# EAGLE board Shutdown_2019_v1.0 (EAGLE 9.1.2)
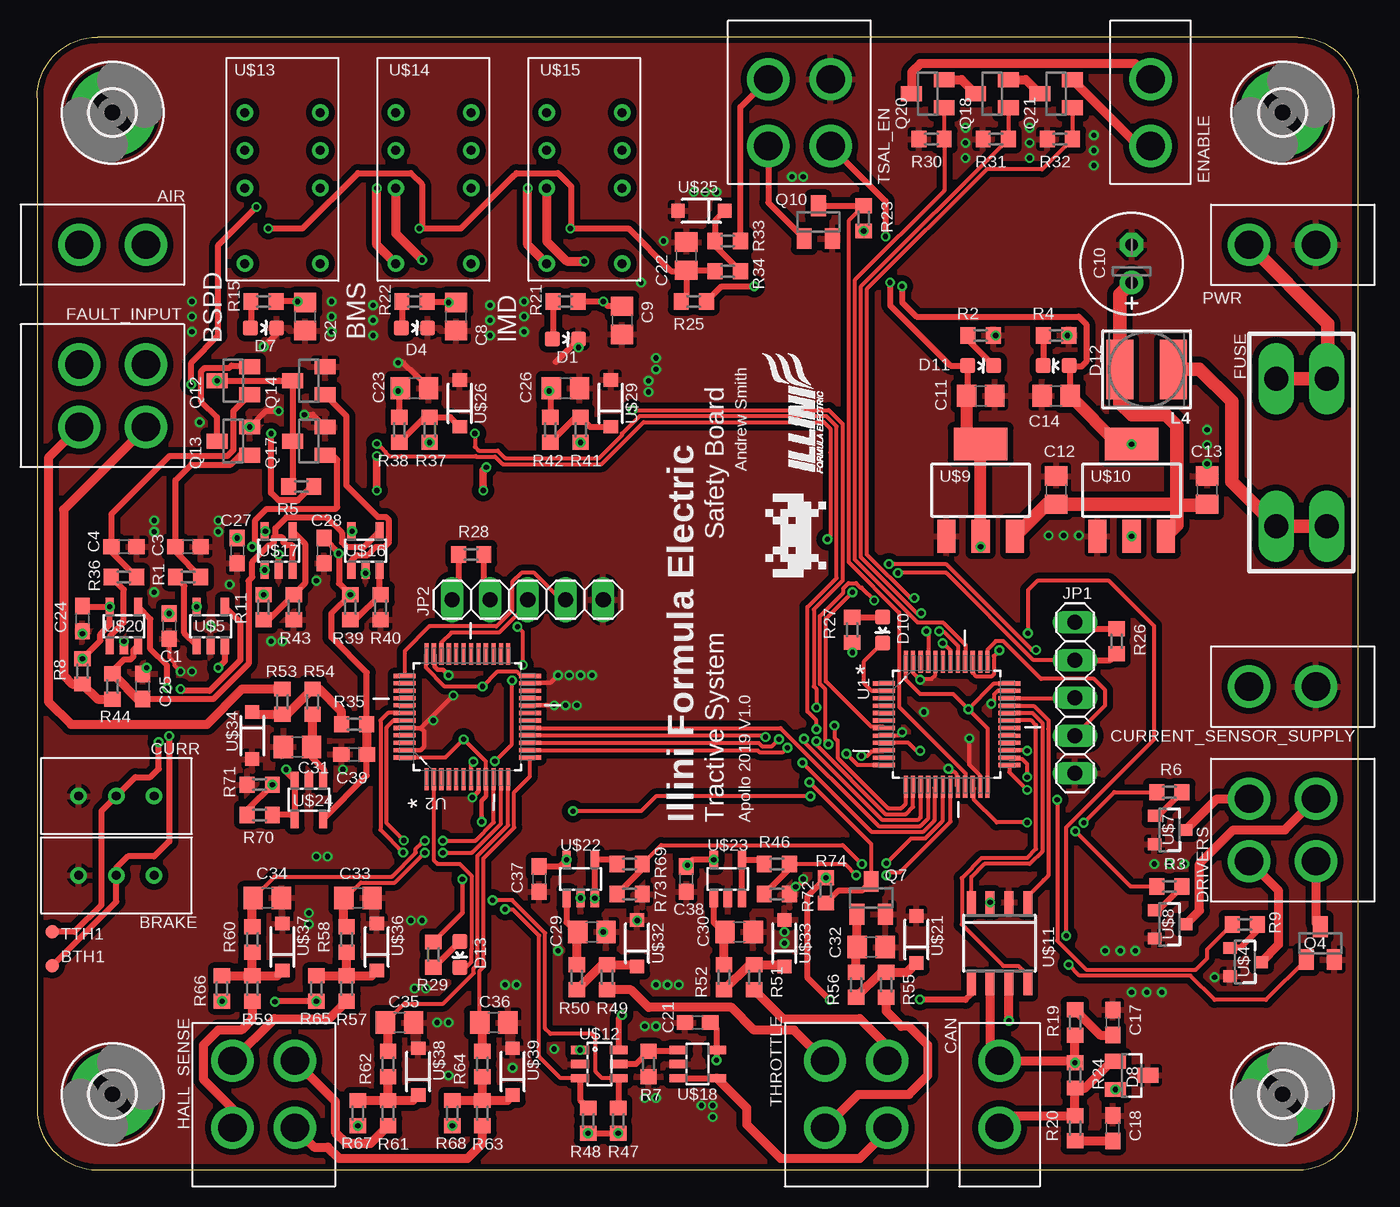
[diagram p10: board, top side]
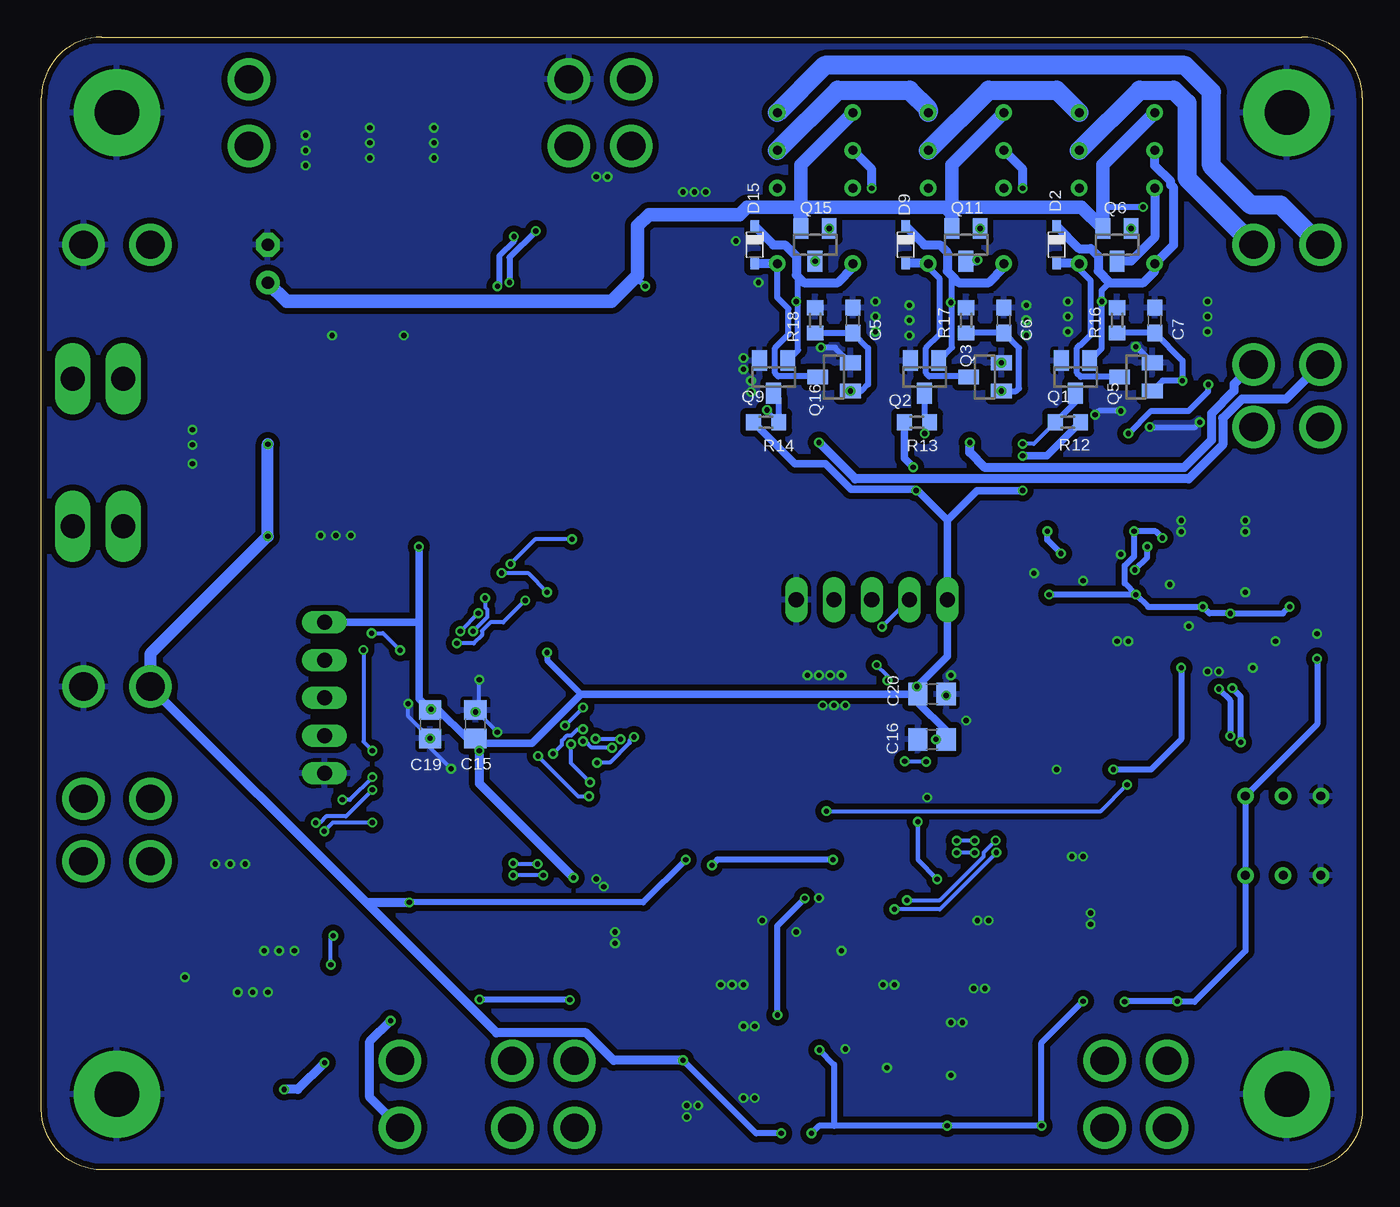
[diagram p11: board, bottom side, seen from below]

Size 88.9 x 76.2 mm. Coordinates in mm from the lower left corner, seen from the top.
Outline: 4.06,0 84.84,0 arc90 88.9,4.06 88.9,72.14 arc90 84.84,76.2 4.06,76.2 arc90 0,72.14 0,4.06 arc90 4.06,0
Copper layers (1*16): Top 0.035mm / dielectric 1.5mm / Bottom 0.035mm
Design rules "SeeedStudio_2layer_DRU_no_angle_20140221": minimum track width 6mil, minimum drill 12mil, track to track 6mil, track to pad 6mil, pad to pad 6mil, via to via 6mil, smd to smd 0mil, copper to edge 10mil, drill to drill 10mil, minimum pad ring 10mil, minimum via ring 6mil, stop-mask expansion 2mil, vias tented up to drill 100mil, thermal gap 10mil
Net classes: 0 default: width 0.254 mm; 1 PWR: width 0.254 mm; 2 AIR: width 1.27 mm; 3 PWR_IN: width 0.406 mm

## Footprints (pad centres in the part's own frame; a part is rotated, then mirrored left to right if it is on the bottom)
MINIFIT_JR_5566-02 = drill 1.9: 1 0,2.25; 2 0,-2.25
PV36 = drill 0.6: A -2.54,0; B 2.54,0; W 0,0
TP09R = smd 0.9 x 0.9: TP 0,0
C0603 = smd 1.1 x 1: 1 -0.85,0; 2 0.85,0
C0805 = smd 1.3 x 1.5: 1 -0.95,0; 2 0.95,0
E2,5-7 = drill 0.813 pad 1.6: + -1.27,0 | drill 0.813 pad 1.6 octagon: - 1.27,0
LED-0603 = smd 1 x 1: A 0,-0.877; C 0,0.877
SOD323-F = smd 0.8 x 0.6: A 1.25,0; C -1.25,0
SOT23 = smd 1 x 1.4: 1 -0.95,-1.1; 2 0.95,-1.1; 3 0,1.1
MINIFIT_JR_5566-04 = drill 1.9: 1 -2.1,2.25; 2 2.1,2.25; 3 -2.1,-2.25; 4 2.1,-2.25
3568 = drill 1.6 long: P$1 -4.96,1.7; P$2 4.96,1.7; P$3 4.96,-1.7; P$4 -4.96,-1.7
3,0-PAD = drill 3 pad 5.842: B3,0 0,0
1X05 = drill 1.016 long: 1 -5.08,0; 2 -2.54,0; 3 0,0; 4 2.54,0; 5 5.08,0
INDUCTOR_5X5MM_NR5040_NOTHERMALS = smd 1.8 x 4: P$1 -1.8,0; P$2 1.8,0
R0603 = smd 1 x 1.1: 1 -0.85,0; 2 0.85,0
QFP50P900X900X160-48N = smd 1.473 x 0.279: 1 -4.216,2.743; 2 -4.216,2.261; 3 -4.216,1.753; 4 -4.216,1.245; 5 -4.216,0.762; 6 -4.216,0.254; 7 -4.216,-0.254; 8 -4.216,-0.762; 9 -4.216,-1.245; 10 -4.216,-1.753; 11 -4.216,-2.261; 12 -4.216,-2.743; 25 4.216,-2.743; 26 4.216,-2.261; 27 4.216,-1.753; 28 4.216,-1.245; 29 4.216,-0.762; 30 4.216,-0.254; 31 4.216,0.254; 32 4.216,0.762; 33 4.216,1.245; 34 4.216,1.753; 35 4.216,2.261; 36 4.216,2.743 | smd 0.279 x 1.473: 13 -2.743,-4.216; 14 -2.261,-4.216; 15 -1.753,-4.216; 16 -1.245,-4.216; 17 -0.762,-4.216; 18 -0.254,-4.216; 19 0.254,-4.216; 20 0.762,-4.216; 21 1.245,-4.216; 22 1.753,-4.216; 23 2.261,-4.216; 24 2.743,-4.216; 37 2.743,4.216; 38 2.261,4.216; 39 1.753,4.216; 40 1.245,4.216; 41 0.762,4.216; 42 0.254,4.216; 43 -0.254,4.216; 44 -0.762,4.216; 45 -1.245,4.216; 46 -1.753,4.216; 47 -2.261,4.216; 48 -2.743,4.216
SOT23-3 = smd 0.8 x 0.9: 1 -0.95,-1; 2 0.95,-1; 3 0,1.1
SOT23-5 = smd 0.55 x 1.2: 1 -0.95,-1.3; 2 0,-1.3; 3 0.95,-1.3; 4 0.95,1.3; 5 -0.95,1.3
SOT223 = smd 1.219 x 2.235: 1 -2.311,-3.099; 2 0,-3.099; 3 2.311,-3.099 | smd 3.6 x 2.2: 4 0,3.099
SOIC8 = smd 0.6 x 1.5: 1 -1.905,-2.75; 2 -0.635,-2.75; 3 0.635,-2.75; 4 1.905,-2.75; 5 1.905,2.75; 6 0.635,2.75; 7 -0.635,2.75; 8 -1.905,2.75
SOT23-6 = smd 0.55 x 1.2: 1 -0.95,-1.3; 2 0,-1.3; 3 0.95,-1.3; 4 0.95,1.3; 5 0,1.3; 6 -0.95,1.3
DPDT_2.54 = drill 0.6: $P1 -6.35,2.54; $P3 -1.27,2.54; $P4 1.27,2.54; $P5 3.81,2.54; $P8 3.81,-2.54; $P9 1.27,-2.54; $P10 -1.27,-2.54; $P12 -6.35,-2.54
SOD-123 = smd 0.9 x 0.95: A 1.575,0; C -1.575,0

## Placement (x,y rotation side)
AIR  MINIFIT_JR_5566-02  [MINIFIT_JR_5566-02]  5.08,62.23 270 top
BRAKE  PV36  [PV36]  5.33,19.81 180 top
BTH1  TPTP09R  [TP09R]  1.02,13.72 270 top
C1  0.1u  [C0603]  8.89,36.58 270 top
C2  10uF  [C0805]  18.03,57.4 270 top
C3  3u  [C0603]  10.16,41.91 0 top
C4  3u  [C0603]  5.84,41.91 0 top
C5  0.1u  [C0603]  34.29,57.15 90 bottom
C6  0.1u  [C0603]  24.13,57.15 90 bottom
C7  0.1u  [C0603]  13.97,57.15 90 bottom
C8  10uF  [C0805]  28.19,57.4 270 top
C9  10uF  [C0805]  39.37,57.15 270 top
C10  220u  [E2,5-7]  73.66,60.96 90 top
C11  2.2u  [C0805]  63.5,52.07 0 top
C12  4.7u  [C0805]  68.58,45.72 90 top
C13  4.7u  [C0805]  78.74,45.72 90 top
C14  2.2u  [C0805]  68.58,52.07 180 top
C15  1u  [C0805]  59.69,29.97 90 bottom
C16  1u  [C0805]  28.96,28.96 180 bottom
C17  560p  [C0603]  72.39,9.91 90 top
C18  560p  [C0603]  72.39,2.79 90 top
C19  1u  [C0805]  62.74,29.97 270 bottom
C20  1u  [C0805]  28.96,32 0 bottom
C21  1u  [C0603]  44.45,9.91 180 top
C22  0.1u  [C0805]  43.69,61.47 90 top
C23  0.1u  [C0805]  25.4,52.58 0 top
C24  0.1u  [C0603]  3.05,37.08 270 top
C25  0.01u  [C0603]  7.11,32.51 90 top
C26  0.1u  [C0805]  35.56,52.58 0 top
C27  0.1u  [C0603]  13.46,41.66 270 top
C28  0.1u  [C0603]  19.3,41.66 270 top
C29  0.1u  [C0805]  37.34,16 0 top
C30  0.1u  [C0805]  47.24,16 0 top
C31  0.001u  [C0805]  17.53,28.45 180 top
C32  0.1u  [C0805]  56.13,14.99 0 top
C33  0.001u  [C0805]  21.59,18.29 0 top
C34  0.001u  [C0805]  15.49,18.29 0 top
C35  0.001u  [C0805]  24.38,9.91 0 top
C36  0.001u  [C0805]  30.73,9.91 0 top
C37  0.1u  [C0603]  33.78,19.56 270 top
C38  0.1u  [C0603]  43.69,19.56 270 top
C39  0.1u  [C0603]  21.34,27.94 180 top
CAN  MINIFIT_JR_5566-02  [MINIFIT_JR_5566-02]  64.77,5.08 0 top
CURR  PV36  [PV36]  5.33,25.15 180 top
CURRENT_SENSOR_SUPPLY  MINIFIT_JR_5566-02  [MINIFIT_JR_5566-02]  83.82,32.51 90 top
D1  BLUE  [LED-0603]  35.56,55.88 270 top
D2  1N914  [SOD323-F]  20.57,62.23 270 bottom
D4  BLUE  [LED-0603]  25.4,56.64 270 top
D7  BLUE  [LED-0603]  15.24,56.64 270 top
D8  PESD1  [SOT23]  73.66,6.35 270 top
D9  1N914  [SOD323-F]  30.73,62.23 270 bottom
D10  RED  [LED-0603]  56.9,36.32 180 top
D11  GREEN  [LED-0603]  63.5,54.1 270 top
D12  GREEN  [LED-0603]  68.58,54.1 90 top
D13  RED  [LED-0603]  28.45,14.48 180 top
D15  1N914  [SOD323-F]  40.89,62.23 270 bottom
DRIVERS  MINIFIT_JR_5566-04  [MINIFIT_JR_5566-04]  83.82,22.86 90 top
ENABLE  MINIFIT_JR_5566-02  [MINIFIT_JR_5566-02]  74.93,71.12 180 top
FAULT_INPUT  MINIFIT_JR_5566-04  [MINIFIT_JR_5566-04]  5.08,52.07 270 top
FUSE  MINI297-3568  [3568]  85.09,48.26 270 top
H1  MOUNT-PAD-ROUND3.0  [3,0-PAD]  83.82,71.12 0 top
H2  MOUNT-PAD-ROUND3.0  [3,0-PAD]  83.82,5.08 0 top
H3  MOUNT-PAD-ROUND3.0  [3,0-PAD]  5.08,5.08 0 top
H4  MOUNT-PAD-ROUND3.0  [3,0-PAD]  5.08,71.12 0 top
HALL_SENSE  MINIFIT_JR_5566-04  [MINIFIT_JR_5566-04]  15.24,5.08 0 top
JP1  [1X05]  69.85,31.75 270 top
JP2  [1X05]  33.02,38.35 0 top
L4  10u  [INDUCTOR_5X5MM_NR5040_NOTHERMALS]  74.68,53.85 180 top
PWR  MINIFIT_JR_5566-02  [MINIFIT_JR_5566-02]  83.82,62.23 90 top
Q1  DMN6140L-7  [SOT23]  19.3,53.34 180 bottom
Q2  DMN6140L-7  [SOT23]  29.46,53.34 180 bottom
Q3  DMN6140L-7  [SOT23]  25.4,53.34 90 bottom
Q4  DMN6140L-7  [SOT23]  86.36,15.24 0 top
Q5  DMN6140L-7  [SOT23]  15.24,53.34 90 bottom
Q6  DMP3099L-7  [SOT23]  16.51,62.23 180 bottom
Q7  DMN6140L-7  [SOT23]  56.13,18.29 0 top
Q9  DMN6140L-7  [SOT23]  39.62,53.34 180 bottom
Q10  DMN6140L-7  [SOT23]  52.58,63.75 0 top
Q11  DMP3099L-7  [SOT23]  26.67,62.23 180 bottom
Q12  IRLML6346PBF  [SOT23]  13.21,53.09 90 top
Q13  IRLML6346PBF  [SOT23]  13.21,49.02 90 top
Q14  IRLML6346PBF  [SOT23]  18.29,53.09 90 top
Q15  DMP3099L-7  [SOT23]  36.83,62.23 180 bottom
Q16  DMN6140L-7  [SOT23]  35.56,53.34 90 bottom
Q17  IRLML6346PBF  [SOT23]  18.29,49.02 90 top
Q18  DMN6140L-7  [SOT23]  64.26,72.39 90 top
Q20  DMN6140L-7  [SOT23]  59.94,72.39 90 top
Q21  DMN6140L-7  [SOT23]  68.58,72.39 90 top
R1  100k  [R0603]  10.16,39.88 180 top
R2  100  [R0603]  63.5,56.13 180 top
R3  3.6k  [R0603]  76.2,19.05 0 top
R4  100  [R0603]  68.58,56.13 180 top
R5  10k  [R0603]  17.78,45.97 0 top
R6  3.6k  [R0603]  76.2,25.4 0 top
R7  50k  [R0603]  41.15,7.11 90 top
R8  10k  [R0603]  3.05,33.53 90 top
R9  1k  [R0603]  81.28,16.51 0 top
R11  1k  [R0603]  15.24,37.85 90 top
R12  10k  [R0603]  19.81,50.29 0 bottom
R13  10k  [R0603]  29.97,50.29 180 bottom
R14  10k  [R0603]  40.13,50.29 180 bottom
R15  900  [R0603]  15.24,58.42 180 top
R16  10k  [R0603]  16.51,57.15 270 bottom
R17  10k  [R0603]  26.67,57.15 270 bottom
R18  10k  [R0603]  36.83,57.15 270 bottom
R19  100  [R0603]  69.85,9.91 270 top
R20  100  [R0603]  69.85,2.79 90 top
R21  900  [R0603]  35.56,58.42 180 top
R22  900  [R0603]  25.4,58.42 180 top
R23  10k  [R0603]  55.63,64.01 270 top
R24  120  [R0603]  69.85,6.35 270 top
R25  1k  [R0603]  44.2,58.42 0 top
R26  10k  [R0603]  72.64,35.56 270 top
R27  10k  [R0603]  54.86,36.32 90 top
R28  10k  [R0603]  29.21,41.4 0 top
R29  10k  [R0603]  26.67,14.48 270 top
R30  10k  [R0603]  60.2,69.34 0 top
R31  10k  [R0603]  64.52,69.34 0 top
R32  10k  [R0603]  68.83,69.34 0 top
R33  100  [R0603]  46.48,62.48 180 top
R34  100k  [R0603]  46.48,60.45 180 top
R35  1k  [R0603]  21.34,29.97 0 top
R36  100k  [R0603]  5.84,39.88 180 top
R37  100  [R0603]  26.42,49.78 90 top
R38  100k  [R0603]  24.38,49.78 90 top
R39  10k  [R0603]  21.08,37.85 90 top
R40  1k  [R0603]  23.11,37.85 90 top
R41  100  [R0603]  36.58,49.78 90 top
R42  100k  [R0603]  34.54,49.78 90 top
R43  10k  [R0603]  17.27,37.85 90 top
R44  1k  [R0603]  5.08,32.51 270 top
R46  10k  [R0603]  49.78,20.57 180 top
R47  10k  [R0603]  39.12,3.3 90 top
R48  10k  [R0603]  37.08,3.3 90 top
R49  10  [R0603]  38.35,12.95 90 top
R50  100k  [R0603]  36.32,12.95 90 top
R51  10  [R0603]  48.26,12.95 90 top
R52  100k  [R0603]  46.23,12.95 90 top
R53  10  [R0603]  16.51,31.5 270 top
R54  10k  [R0603]  18.54,31.5 270 top
R55  100  [R0603]  57.15,12.45 90 top
R56  100k  [R0603]  55.12,12.45 90 top
R57  10  [R0603]  20.83,12.19 90 top
R58  10k  [R0603]  20.83,15.49 90 top
R59  10  [R0603]  14.48,12.19 90 top
R60  10k  [R0603]  14.48,15.49 90 top
R61  10  [R0603]  23.62,3.81 90 top
R62  10k  [R0603]  23.62,7.11 90 top
R63  10  [R0603]  29.97,3.81 90 top
R64  10k  [R0603]  29.97,7.11 90 top
R65  1k  [R0603]  18.8,12.19 270 top
R66  1k  [R0603]  12.45,12.19 270 top
R67  1k  [R0603]  21.59,3.81 270 top
R68  1k  [R0603]  27.94,3.81 270 top
R69  10k  [R0603]  39.88,20.57 180 top
R70  10k  [R0603]  14.99,23.88 0 top
R71  15k  [R0603]  14.99,25.91 0 top
R72  15k  [R0603]  49.78,18.54 180 top
R73  15k  [R0603]  39.88,18.54 180 top
R74  10k  [R0603]  53.09,18.8 90 top
THROTTLE  MINIFIT_JR_5566-04  [MINIFIT_JR_5566-04]  55.12,5.08 0 top
TSAL_EN  MINIFIT_JR_5566-04  [MINIFIT_JR_5566-04]  51.31,71.12 180 top
TTH1  TPTP09R  [TP09R]  1.02,16 270 top
U1  STM32F103CBT6  [QFP50P900X900X160-48N]  61.21,29.97 0 top
U2  STM32F103CBT6  [QFP50P900X900X160-48N]  28.96,30.48 90 top
U$4  DNBT8105  [SOT23-3]  81.28,13.97 270 top
U$5  TS881  [SOT23-5]  11.68,36.58 0 top
U$7  DNBT8105  [SOT23-3]  76.2,22.86 270 top
U$8  DNBT8105  [SOT23-3]  76.2,16.51 270 top
U$9  SPX1117M3-L-3-3  [SOT223]  63.5,45.72 0 top
U$10  SPX1117M3-L-5-0  [SOT223]  73.66,45.72 0 top
U$11  MCP2562  [SOIC8]  64.77,15.24 180 top
U$12  MCP4018  [SOT23-6]  37.85,7.11 270 top
U$13  EC2  [DPDT_2.54]  16.51,67.31 90 top
U$14  EC2  [DPDT_2.54]  26.67,67.31 90 top
U$15  EC2  [DPDT_2.54]  36.83,67.31 90 top
U$16  TS881  [SOT23-5]  22.1,41.66 0 top
U$17  TS881  [SOT23-5]  16.26,41.66 0 top
U$18  LMV321L  [SOT23-5]  44.45,7.11 270 top
U$20  TS881  [SOT23-5]  5.84,36.58 0 top
U$21  BZT52C13  [SOD-123]  59.18,15.49 90 top
U$22  LMV321L  [SOT23-5]  36.58,19.56 0 top
U$23  LMV321L  [SOT23-5]  46.48,19.56 0 top
U$24  LMV321L  [SOT23-5]  18.29,24.89 180 top
U$25  BZT52C13  [SOD-123]  44.7,64.52 180 top
U$26  BZT52C13  [SOD-123]  28.45,51.56 90 top
U$29  BZT52C13  [SOD-123]  38.61,51.56 90 top
U$32  BZT52C5V6  [SOD-123]  40.39,15.24 90 top
U$33  BZT52C5V6  [SOD-123]  50.29,15.24 90 top
U$34  BZT52C5V6  [SOD-123]  14.48,29.21 270 top
U$36  BZT52C5V6  [SOD-123]  22.86,14.99 90 top
U$37  BZT52C5V6  [SOD-123]  16.51,14.99 90 top
U$38  BZT52C5V6  [SOD-123]  25.65,6.6 90 top
U$39  BZT52C5V6  [SOD-123]  32,6.6 90 top

## Tracks (layer width: path | path; a pad name or v marks a point on that pad's centre or on a via)
!RST  (via drill 0.35)
  Top 0.254: U1.7 56.91,29.81 56.15,29.81 53.09,32.87 53.09,37.08 v54.86,38.86 | JP1.2 67.06,34.29 61.19,40.15 v57.93,40.15
  Top 0.406: JP1.2 72.22,34.29 R26.2
  Bottom 0.254: v57.93,40.15 56.16,40.15 v54.86,38.86
!RST_TC  (via drill 0.35)
  Top 0.254: U2.7 29.21,27.31 v29.35,27.45 | v30.81,27.48 31.96,28.63 v31.96,32.92 | v32.69,33.96 32.69,36.17 v32.33,36.53
  Top 0.406: R28.2 30.06,38.77 JP2.2
  Bottom 0.254: v29.35,27.45 30.78,27.45 v30.81,27.48 | v31.96,32.92 31.96,33.23 v32.69,33.96 | v32.33,36.53 30.5,38.35 JP2.2
+3V3  (via drill 0.35)
  Top 0.254: v62.67,30.99 61.66,32 59.44,32 58.47,32.97 U1.48 | v62.67,30.99 64.4,32.72 U1.36 | v62.67,30.99 63.96,29.7 U1.24 | v59.44,28.19 59.18,28.19 58.65,28.73 U1.9 | U2.9 30.2,27.46 v28.7,28.96 27.48,27.74 U2.48 | U2.36 26.16,34.65 26.16,33.78 27.43,32.51 v29.97,32.51 30.99,33.53 32.26,33.53 32.56,33.22 U2.24
  Top 0.305: R29.1 28.62,17.28 v28.62,19.54 | v29.92,23.42 29.92,24.84 30.23,25.15 30.23,26.24 U2.9
  Top 0.406: C11.1 62.62,52.14 D11.A 61.47,54.1 57.4,58.17 v57.4,59.69 | R28.1 28.36,38.77 JP2.1 | JP1.1 70.27,36.41 R26.1 | R27.1 v54.86,34.8 | R74.2 51.82,18.38 51.82,12.95 v53.34,11.43 | v59.41,11.46 62.45,11.46 62.48,11.43 62.87,11.81 U$11.5
  Top 0.508: v30.02,45.7 30.02,47.06 v30.23,47.27 | v22.86,48.03 v22.86,45.7
  Top 0.813: C11.1 62.55,49.77 U$9.4 U$9.2 v63.5,41.91
  Bottom 0.254: C15.1 59.69,28.45 v59.44,28.19 | v28.7,28.96 C16.1
  Bottom 0.305: v28.62,19.54 29.92,20.84 v29.92,23.42
  Bottom 0.406: v54.86,34.8 54.86,34.29 52.58,32 | C19.1 v62.67,30.99 | v53.34,11.43 59.38,11.43 v59.41,11.46 | R23.2 57.4,61.38 v57.4,59.69
  Bottom 0.508: v63.5,41.91 63.5,36.83 | 63.5,36.83 63.5,31.68 C19.1 | JP1.1 63.5,36.83 | C15.1 60.26,29.02 | 60.26,29.02 62.23,30.99 v62.67,30.99 | C20.1 29.91,31.43 28.01,29.53 C16.1 | C20.1 29.97,32.07 v29.97,32.51 27.94,34.54 JP2.1 27.94,43.69 | C20.1 52.58,32 55.88,28.7 59.94,28.7 60.26,29.02 | 30.02,45.77 34.42,45.77 36.15,47.5 38.19,47.5 R14.2 | 27.94,43.69 30.02,45.77 | 30.02,45.77 v30.02,45.7 | v30.23,47.27 30.82,47.86 R13.2 | R12.2 21.23,48.03 v22.86,48.03 | v22.86,45.7 25.93,45.7 27.94,43.69
  Bottom 0.61: v59.44,28.19 59.44,26 R74.2
  other vias: 53.09,19.65 55.63,63.16
+5V  (via drill 0.35)
  Top 0.406: C14.1 69.53,54.03 | 69.53,54.03 D12.A | R8.2 4.26,35.59 4.26,36.04 4.89,36.67 U$20.5 3.11,37.88 C24.1 | C28.1 20.32,41.49 | 20.32,41.49 20.32,39.46 R39.2 19.81,37.43 19.81,35.81 22.19,33.44 R35.2 | v15.36,42.96 U$17.5 | 20.32,41.49 v20.3,41.47 | v21.2,42.96 U$16.5 | R65.2 16.04,11.34 v16,11.3 | R48.1 R47.1 | v45.72,7.37 45.75,7.4 U$18.5 45.75,9.46 C21.1 | U$24.5 22.19,26.54 C39.1 | C37.1 35.18,20.41 U$22.5 | U$23.5 44.14,20.86 v43.77,20.49 C38.1 | TSAL_EN.1 57.1,65.18 v57.1,62.79 | v58.21,59.44 58.21,58.38 59.18,57.4 70.1,57.4 70.61,56.9 70.61,54.36 70.28,54.03 69.53,54.03
  Top 0.61: R35.2 C39.1
  Top 0.813: U$10.4 72.78,48.82 C14.1
  Bottom 0.406: U$20.5 5.34,37.43 C1.1 10.28,37.43 U$5.5 14.42,37.88 R11.2 | R11.2 19.3,38.7 R39.2 | C27.1 13.91,42.96 v15.36,42.96 15.36,41.27 15.99,40.64 15.99,39.45 R11.2 | v20.3,41.47 21.2,42.37 v21.2,42.96 | R8.2 3.05,29.97 CURR.A BRAKE.A 7.87,14.73 11.3,11.3 12.45,11.3 R66.2 15.96,11.34 v16,11.3 | R65.2 21.59,8.55 R67.2 R68.2 35.56,2.96 | 35.56,2.96 36.58,2.96 R48.1 | R47.1 40.81,2.45 v45.72,7.37 | U$12.1 35.56,7.08 35.56,2.96 | U$22.5 43.4,20.86 v43.77,20.49 | U$23.5 48.4,17.99 v64.14,17.99 | v57.1,62.79 57.1,62.47 58.09,61.49 58.09,59.56 v58.21,59.44
  Bottom 0.61: CURRENT_SENSOR_SUPPLY.1 67.05,17.99 | 67.05,17.99 v64.14,17.99 | v45.72,7.37 50.39,7.37 52.24,9.21 58.27,9.21 67.05,17.99
  Bottom 0.813: U$10.4 U$10.2 81.57,34.71 CURRENT_SENSOR_SUPPLY.1
  other vias: 73.66,42.62 73.66,48.82 8.89,37.43 10.73,37.88 4.89,37.88 15.24,38.7 21.08,38.7 13.46,42.51 3.05,34.38 12.45,11.34 21.59,2.96 27.94,2.96 18.8,11.34 37.08,2.45 39.12,2.45 36.55,8.06 35.63,20.86 45.53,20.86
+12V  (via drill 0.35)
  Top 0.406: R25.2 46.06,59.44 v48.26,59.44 | R5.2 18.48,45.97 17.54,45.03 16.26,45.03 15.75,45.54 v15.75,49.53 | v10.37,52.83 10.37,54.31 12.19,56.13 12.19,62.21 v14.76,64.77
  Top 0.914: C10.+ 72.88,58.91 L4.P$2 72.88,51.58 73.66,50.8 75.96,50.8 76.71,50.05 76.71,44.7 | U$10.3 76.71,43.36 76.71,44.7 | 76.71,44.7 78.67,44.7 C13.1 | U$9.3 67.96,44.77 C12.1 76.64,44.77 76.71,44.7
  Bottom 0.406: v48.26,59.44 48.77,59.94 48.77,60.2 | v15.75,49.53 14.22,51.05 11.68,51.05 10.37,52.37 v10.37,52.83 | v14.76,64.77 17.46,64.77
  Bottom 0.914: 27.62,64.32 27.62,64.33 27.18,64.77 20.83,64.77 18.9,64.77 Q6.2 17.46,64.77 17.46,67.63 U$13.$P5 | 27.62,64.32 Q11.2 27.62,64.32 | 27.62,64.32 28.07,64.77 37.34,64.77 37.85,64.26 37.78,64.2 | 37.78,64.2 Q15.2 | U$15.$P5 37.78,67.63 37.78,64.77 | 37.78,64.77 37.78,64.2 | U$14.$P5 27.62,67.63 27.62,64.32 | C10.+ 72.39,58.42 50.55,58.42 48.77,60.2 48.77,63.5 48.01,64.26 41.91,64.26 41.4,64.77 37.78,64.77
AIR_IN
  Bottom 1.27: U$13.$P9 14.99,72.64 12.7,72.64 11.81,71.75 11.81,66.71 AIR.1
AIR_OUT
  Bottom 1.27: AIR.2 5.5,64.9 7.49,64.9 10.16,67.56 10.16,72.52 11.94,74.3 36.2,74.3 U$15.$P8
APPS_EN
  Top 0.254: Q20.1 R30.2 61.05,65.87 55.02,59.84 55.02,41.06 59.25,36.83 60.96,36.83 62.48,35.31 62.46,35.28 U1.40
BRAKE_LIGHT-
  Top 0.61: U$4.3 83.57,15.16 83.57,18.76 DRIVERS.1
BRAKE_LIGHT_EN  (via drill 0.35)
  Top 0.254: U1.26 65.49,27.65 66.28,27.65 66.63,27.3 v66.63,26.42 | v68.65,24.89 68.65,15.42 70.61,13.46 77.98,13.46 78.74,14.22 78.74,14.82 R9.1
  Bottom 0.254: v66.63,26.42 68.15,24.89 v68.65,24.89
BRAKE_PRESSURE
  Top 0.61: FAULT_INPUT.4 0.76,47.9 0.76,31.5 2.29,29.97 11.43,29.97 13.8,32.35 R53.1
BRAKE_PRESSURE_F  (via drill 0.35)
  Top 0.406: R70.2 17.05,23.88 U$24.4 U$24.3 16.76,26.77 v16.76,26.92 | U$5.3 12.63,34.23 v12.19,33.78
  Bottom 0.406: v12.19,33.78 12.19,28.96 14.22,26.92 v16.76,26.92
BRAKE_PRESSURE_F_3_3  (via drill 0.35)
  Top 0.254: U1.10 56.91,28.13 56.15,28.13 55.85,27.84 v55.48,27.84 | v52.05,25.13 41.64,25.13 40.64,24.13 v36.07,24.13
  Top 0.406: R71.2 14.14,24.21 R70.1
  Bottom 0.254: v55.48,27.84 52.77,25.13 v52.05,25.13 | v36.07,24.13 17.61,24.13 R71.2
  other vias: 15.84,25.91
BRAKE_TH  (via drill 0.35)
  Top 0.406: U$5.4 13.66,36.84 13.66,34.29 11.6,32.22 9.78,32.22 v9.65,32.34 | v8.89,29.19 8.89,22.1 7.87,21.08 6.1,21.08 5.33,20.32 BRAKE.W 5.33,18.03 BTH1.TP
  Bottom 0.406: v9.65,32.34 8.89,31.58 v8.89,29.19
BSPD_BRAKE_COND
  Top 0.406: R1.1 9.31,41.58 C3.1 9.31,46.39 10.36,47.45 13.03,47.45 13.65,48.07 Q13.1
BSPD_CURR_COND
  Top 0.406: R36.1 4.99,41.58 C4.1 4.99,44.11 8.89,48.01 12.79,48.01 13.21,48.42 13.21,51.04 Q12.1
BSPD_OC  (via drill 0.35)
  Top 0.406: v14.48,41.91 14.68,42.11 14.68,43.7 15.44,44.47 20.09,44.47 20.19,44.58 20.19,47.75 19.87,48.07 Q17.1
  Bottom 0.406: U$17.1 14.48,41.18 v14.48,41.91
  other vias: 15.31,40.36
BSPD_SC
  Top 0.406: U$16.1 21.15,40.96 21.54,41.35 22.23,41.35 22.79,41.91 23.38,41.91 23.68,42.21 23.68,43.7 23.47,43.91 22.95,43.91 20.83,46.03 20.83,50.7 Q14.1
BTSF_EN  (via drill 0.35)
  Top 0.254: Q18.1 R31.2 55.42,59.4 55.42,41.23 59.22,37.44 v59.5,37.44 | v60.71,36.22 60.99,36.22 61.98,35.24 U1.41
  Bottom 0.254: v59.5,37.44 60.71,36.23 v60.71,36.22
CAN_RX
  Top 0.254: U$11.4 62.87,19.68 63.75,20.57 66.8,20.57 67.64,21.41 67.64,30.08 66.99,30.73 U1.32
CAN_STBY
  Top 0.254: U1.31 66.92,30.23 67.23,29.91 67.23,21.58 66.63,20.98 63.59,20.98 62.23,19.62 62.23,16.51 65.02,13.72 66.04,13.72 66.67,13.08 U$11.8
CAN_TX
  Top 0.254: U1.33 67.08,31.22 68.07,30.23 68.07,29.67 68.05,29.64 68.05,19.79 67.75,19.49 66.67,18.41 U$11.1
CANH  (via drill 0.35)
  Top 0.61: CAN.2 65.58,3.64 R20.2 R24.2 70.52,5.5 72.32,7.3 D8.1 | v65.41,10.03 U$11.7
  Bottom 0.61: CAN.2 66.8,4.86 66.8,8.64 v65.41,10.03
CANL  (via drill 0.35)
  Top 0.61: R19.2 R24.1 69.72,7.33 CAN.1 64.14,7.96 U$11.6
  Bottom 0.61: R24.1 71.65,5.4 D8.2
  other vias: 69.85,7.2 72.56,5.4
CURR_TH  (via drill 0.35)
  Top 0.406: v8.18,28.75 8.18,26.98 7.62,26.42 6.6,26.42 CURR.W 4.32,24.13 4.32,17.81 2.51,16 TTH1.TP | v8.74,32.4 8.74,33.93 7.62,35.05 7.62,37.05 U$20.4
  Bottom 0.406: v8.18,28.75 8.18,31.84 v8.74,32.4
CURRENT_SENSE
  Top 0.61: FAULT_INPUT.2 1.78,44.42 1.78,33.27 2.37,32.68 R8.1 4.06,31.66 R44.2
CURRENT_SENSE_F
  Top 0.406: U$16.4 22,41.91 20.83,41.91 20.74,42 20.73,42 20.52,42.21 20.52,42.84 19.45,43.91 16.78,43.91 16.04,43.17 16.04,42.67 15.94,42.57 | C25.1 11.85,31.66 14.22,34.04 14.22,39.62 14.48,39.88 14.48,40.91 15.57,42 15.73,42 15.94,42.21 15.94,42.57 | 5.25,33.19 5.25,33.73 5.84,34.32 6.26,34.32 6.47,34.53 6.47,34.96 U$20.3 | 15.94,42.57 16.45,42.57 16.57,42.44 16.57,42.21 16.78,42 17.18,42 17.21,41.98 U$17.3
  Top 0.61: C25.1 6.78,31.66 5.25,33.19 R44.1
DEBUG
  Top 0.254: D10.C 55.63,34.17 55.63,32.77 56.16,32.23 U1.2
DEBUG_TC
  Top 0.254: U2.2 26.7,20.83 26.95,20.57 28.45,20.57 29.23,19.8 29.23,14.83 29.21,14.81 29.21,13.97 28.84,13.6 D13.C
ENABLE_IN
  Top 0.61: Q21.2 74.15,68.87 ENABLE.1
ENABLE_OUT
  Top 0.61: ENABLE.2 73.88,74.42 59.44,74.42 58.84,73.83 Q20.3
FAULT_BMS  (via drill 0.35)
  Bottom 0.61: FAULT_INPUT.1 8.64,52.86 8.64,52.4 10.16,50.88 10.16,49.08 12,47.24 25.4,47.24 26.42,48.26 R37.1
  other vias: 26.42,48.93
FAULT_BMS_F  (via drill 0.35)
  Top 0.406: Q3.1 24.45,52.54 | 24.45,52.54 C23.1 | R38.2 24.38,52.47 24.45,52.54
  Bottom 0.406: Q3.1 23.3,52.39 23.11,52.58 23.11,55.28 C6.1 R17.2
  other vias: 24.3,52.39
FAULT_BMS_STAT  (via drill 0.35)
  Top 0.406: R22.1 26.32,58.35 v27.7,58.35 C8.1
  Top 0.61: U$14.$P1 22.86,62.23 v22.86,66.04
  Bottom 0.406: Q2.1 27.62,55.33 27.62,58.42 | 27.62,58.42 27.62,60.13 | v27.7,58.35 27.63,58.42 27.62,58.42
  Bottom 0.61: D9.C 29.48,62.23 28.45,62.23 27.94,61.72 27.94,60.45 27.62,60.13 27.18,59.69 25.15,59.69 24.13,60.71 U$14.$P1 | v22.86,66.04 22.86,67.31 U$14.$P4
FAULT_BMS_STATUS_3_3  (via drill 0.35)
  Top 0.254: U1.12 55.23,27.23 v54.48,27.98 | v52.45,29.63 52.45,30.24 51.84,30.84 51.84,37.85 53.8,39.8 53.8,50.02 53.11,50.71 40.55,50.71 39.36,49.52 39.36,49.42 39.2,49.26 37.82,47.88 31.5,47.88 30.99,48.39 29.72,48.39 29.46,48.64 v29.46,49.53
  Bottom 0.254: v52.45,29.63 52.83,29.63 53.23,29.23 53.51,29.23 53.87,28.87 53.87,28.59 v54.48,27.98 | v29.46,49.53 29.46,49.95 R13.1
  Bottom 0.406: Q2.3 29.46,50.63 R13.1
FAULT_BSPD  (via drill 0.35)
  Top 0.406: Q12.3 16.26,53.09 Q14.3 Q17.3 17.19,46.23 R5.1
  Bottom 0.406: R16.2 C7.1 12.11,54.44 Q12.3 13.44,53.09 Q5.1
  other vias: 12.11,53.09
FAULT_BSPD_STAT  (via drill 0.35)
  Top 0.406: R15.1 v17.54,58.42 17.97,58.42 C2.1
  Bottom 0.406: Q1.1 17.54,55.25 v17.54,58.42 17.54,59.17 17.02,59.69
  Bottom 0.61: D2.C 19.07,61.98 18.29,61.98 17.78,61.47 17.78,60.45 17.02,59.69 14.73,59.69 13.97,60.45 U$13.$P1 12.7,62.23 12.7,66.06 12.9,66.26 12.9,66.5 13.97,67.56 U$13.$P4
FAULT_BSPD_STATUS_3_3  (via drill 0.35)
  Top 0.254: 24.51,48.01 23.69,48.01 23.47,48.23 23.47,48.28 23.11,48.63 23.06,48.63 v22.86,48.84 | 24.51,48.01 | 24.51,48.01 29.52,48.01 29.55,47.98 30.82,47.98 31.33,47.47 37.99,47.47 40.81,50.3 52.95,50.3 53.39,49.85 53.39,48.26 53.39,42.62 v53.19,42.42 | v67.23,34.97 66.95,34.97 61.16,40.76 v57.33,40.76 | v66.63,28.19 66.6,28.22 U1.27
  Bottom 0.254: R12.1 22.12,48.84 v22.86,48.84 | v53.19,42.42 55.67,42.42 v57.33,40.76 | v67.23,34.97 67.23,28.8 v66.63,28.19
  Bottom 0.406: Q1.3 19.3,51.65 R12.1
FAULT_IMD  (via drill 0.35)
  Bottom 0.61: FAULT_INPUT.3 5.15,51.85 8.11,51.85 9.4,50.56 9.4,48.77 11.68,46.48 34.12,46.48 R41.1
  other vias: 36.58,48.93
FAULT_IMD_F  (via drill 0.35)
  Top 0.406: R42.2 34.54,52.51 C26.1 34.46,52.43 Q16.1
  Bottom 0.406: R18.2 C5.1 33.27,55.28 33.27,52.83 33.72,52.39 Q16.1
  other vias: 34.46,52.39
FAULT_IMD_STAT  (via drill 0.35)
  Top 0.406: R21.1 v38.1,58.42 38.42,58.1 C9.1
  Top 0.61: U$15.$P1 33.02,62.23 v33.02,66.04
  Bottom 0.406: Q9.1 37.97,55.14 37.97,58.42 | 38.1,60.2 37.97,60.07 37.97,58.42 | v38.1,58.42 37.97,58.42
  Bottom 0.61: D15.C 39.64,62.23 38.86,62.23 38.1,61.47 38.1,60.2 37.59,59.69 35.31,59.69 34.29,60.71 U$15.$P1 | v33.02,66.04 33.02,67.31 U$15.$P4
FAULT_IMD_STATUS_3_3  (via drill 0.35)
  Top 0.254: v40.07,51.11 53.28,51.11 54.2,50.19 54.2,39.63 52.27,37.7 52.27,32.53 52.45,32.35 v52.45,31.1 | v53.66,29.88 53.66,29.08 53.87,28.87 53.87,27.73 57.27,24.33 58.17,24.33 58.47,24.64 U1.13
  Bottom 0.254: R14.1 39.28,50.32 v40.07,51.11 | v52.45,31.1 v53.66,29.88
  Bottom 0.406: Q9.3 39.28,51.9 R14.1
FAULT_RESET
  Top 0.406: R33.1 47.33,71.49 TSAL_EN.4
FAULT_RESET_F  (via drill 0.35)
  Top 0.406: C22.1 45.57,60.52 R34.2 | C22.1 43.69,58.76 R25.1 | Q6.1 17.86,63.33 21.59,67.06 25.15,67.06 25.91,66.29 25.91,63.52 Q11.1 28.53,63.33 32,66.8 32.26,67.06 35.05,67.06 35.94,66.17 35.94,63.39 Q15.1 39.79,63.33 42.67,60.45 43.62,60.45 C22.1
  other vias: 15.56,63.33 25.72,63.33 35.88,63.33
GND  (via drill 0.35)
  Top 0.254: U1.23 63.46,26.53 62.74,27.26 C19.2 | v58.21,29.44 57.99,29.21 U1.8 | U1.47 58.95,33.42 59.21,33.17 59.24,33.17 v59.44,32.97 59.48,33.02 60.2,33.02 60.45,33.27 U1.44 | v64.21,31.36 64.41,31.56 64.41,31.98 64.67,32.23 U1.35 | U1.20 61.89,25.84 61.89,26.61 61.72,26.77 61.52,26.77 v61.32,26.97 | U$20.2 v5.84,35.56 | C25.2 7.11,33.53 v7.37,33.78 | C1.2 8.89,34.47 9.23,34.13 9.23,33.95 v9.65,33.53
  Top 0.305: v29.29,25.05 29.46,25.22 29.48,25.22 29.72,25.46 U2.8 | U2.20 34.04,31.24 v34.8,31.24 | U2.44 25.82,29.72 | 25.82,29.72 v28.01,31.91 | U2.35 26.76,34.63 26.76,33.83 26.94,33.66 27.3,33.66 v27.69,33.27 | U2.23 33.2,32.77 34.54,32.77 v35.05,33.27 | v51.05,19.05 51.05,18.96 R72.1 51.56,19.47 v51.56,19.56 | C24.2 v3.05,36.07 | 25.82,29.72 26.04,29.5 26.04,28.45 25.81,28.22 U2.47
  Top 0.406: v15.24,55.37 16.12,56.25 D7.C | Q13.2 15.39,51.05 v16.26,51.05 | v17.98,50.8 18.56,50.8 Q17.2 | C23.2 25.46,53.47 25.46,53.48 24.64,54.29 Q3.2 | v36.44,55.32 D1.C 34.91,54.36 | U$17.2 v16.26,41.4
  Bottom 0.254: v58.21,29.44 v58.21,29.45 C15.2 59.44,31.18 v59.44,32.97 | v64.21,31.36 64.21,30.5 C19.2 62.74,28.39 v61.32,26.97
  Bottom 0.305: v29.29,25.05 29.39,25.15 | v28.01,31.91 C20.2
  Bottom 0.406: Q5.2 15.22,55.37 v15.24,55.37 | v16.26,51.05 17.73,51.05 v17.98,50.8 | Q13.2 11.27,49.97 | Q16.2 35.49,55.32 v36.44,55.32
  other vias: 14.31,49.97 10.94,50.29 24.3,54.29 62.74,29.02 71.88,14.73 72.9,14.73 73.91,14.73 73.66,11.94 74.68,11.94 75.69,11.94 79.25,12.95 44.7,4.32 45.47,4.32 45.47,3.56 40.89,4.83 41.66,4.83 41.66,9.65 40.89,9.65 41.66,12.45 42.42,12.45 43.18,12.45 31.5,12.45 32.26,12.45 26.16,12.19 25.4,12.19 26.92,9.91 27.69,9.91 27.69,6.35 18.29,16.51 18.29,17.27 18.8,21.08 19.56,21.08 25.15,16.76 25.91,16.76 10.41,33.53 20.57,26.92 22.1,40.13 18.8,39.62 35.81,33.27 36.58,33.27 37.34,33.27 35.56,31.24 36.32,31.24 26.67,30.23 69.34,56.13 64.52,56.13 11.68,36.58 12.95,39.37 15.75,35.56 16.51,35.56 7.87,38.86 7.87,42.93 12.19,42.93 7.87,43.69 12.19,43.69 10.41,56.39 10.41,57.4 10.41,58.42 19.81,56.39 19.81,57.4 19.81,58.42 22.61,58.17 22.61,57.15 22.61,56.13 30.48,56.13 30.48,57.15 30.48,58.17 32.77,56.39 32.77,57.4 32.77,58.42 41.15,52.32 41.15,53.09 41.66,53.85 41.66,54.61 40.64,59.69 42.16,62.48 45.72,65.79 44.96,65.79 44.2,65.79 50.8,66.8 51.56,66.8 34.8,8.13 32,6.86 50.29,15.24 50.29,16 62.48,68.07 62.48,69.09 62.48,70.1 66.8,70.1 66.8,69.09 66.8,68.07 71.12,69.6 71.12,68.58 71.12,67.56 35.05,14.73 38.1,16 36.58,18.29 40.39,16.76 59.69,30.8 75.18,20.57 76.2,20.57 77.22,20.57 78.74,47.5 78.74,48.77 78.74,49.78 70.1,42.67 69.09,42.67 68.07,42.67
  pour Top (isolate 0.406): 0,75.95 0,0 88.9,0 88.9,76.2 0,76.2
  pour Bottom (isolate 0.406): 0.25,76.2 0,76.2 0,0 88.9,0 88.9,76.2
HALL_FL
  Top 0.61: HALL_SENSE.1 15.97,10.16 19.65,10.16 R57.1
HALL_FL_F  (via drill 0.35)
  Top 0.254: C33.1 20.75,18.29 21.77,19.32 24.07,19.32 v26.09,21.34 | v27.3,21.34 29.27,21.34 31.22,23.28 U2.11
  Top 0.61: R58.2 20.64,16.53 C33.1
  Bottom 0.254: v26.09,21.34 v27.3,21.34
HALL_FR
  Top 0.61: R59.1 14.48,10.16 13.72,9.4 12.19,9.4 11.18,8.38 11.18,6.1 13.14,4.13 HALL_SENSE.3
HALL_FR_F  (via drill 0.35)
  Top 0.254: C34.1 15.98,19.72 23.88,19.72 25.48,21.33 25.48,21.59 25.84,21.94 25.89,21.94 v26.09,22.14 | v27.3,22.14 29.5,22.14 30.73,23.37 30.73,26.24 U2.10
  Top 0.61: R60.2 14.48,18.22 C34.1
  Bottom 0.254: v26.09,22.14 v27.3,22.14
HALL_RL
  Top 0.61: HALL_SENSE.2 20.07,4.6 20.07,2.54 20.83,1.78 22.44,1.78 R61.1
HALL_RL_F
  Top 0.254: C35.1 24.7,11.18 27.33,11.18 29.38,13.22 29.38,13.56 29.63,13.82 29.63,21.12 31.7,23.19 U2.12
  Top 0.61: R62.2 23.62,9.72 C35.1
HALL_RR
  Top 0.61: HALL_SENSE.4 18.65,1.52 19.56,1.52 20.32,0.76 28.96,0.76 29.97,1.78 R63.1
HALL_RR_F
  Top 0.254: C36.1 29.78,13.39 30.04,13.65 30.04,20.96 32.11,23.02 32.11,25.4 33.17,26.46 U2.13
  Top 0.61: R64.2 29.97,9.72 C36.1
HV_CONNECTED_3_3
  Top 0.254: R23.1 54.61,63.84 54.61,40.89 58.01,37.49 58.01,31.14 62.48,26.67 62.48,25.78 U1.21
  Top 0.406: Q10.3 R23.1
N$1
  Bottom 0.406: Q3.3 26.54,53.38 29.16,53.38 29.37,53.59 29.37,55.29 28.45,56.21 28.45,59.94 29.21,60.71 U$14.$P12
  Bottom 0.61: U$14.$P12 29.23,60.98 D9.A
N$2
  Top 0.61: R56.1 56.82,13.3 R55.2 58.56,13.3 U$21.C
N$3
  Top 0.406: U$4.1 80.35,14.99 81.03,14.99 82.13,16.09 R9.2
N$6
  Top 0.914: FUSE.P$2 FUSE.P$3 80.39,46.3 80.39,51.69 78.23,53.85 L4.P$1
N$8
  Top 0.406: D7.A 14.39,56.67 R15.2
N$9
  Top 0.406: Q13.3 12.11,50.63 11.05,51.69 11.05,53.73 11.26,53.94 12.92,53.94 13.08,54.1 14.24,54.1 Q12.2
N$10
  Top 0.406: R4.2 67.73,54.13 D12.C
N$11
  Top 0.406: R2.2 62.65,55.83 D11.C
N$12
  Top 0.406: U$18.1 43.05,7.96 R7.2 40.3,7.11 U$12.5
N$13
  Top 0.406: U$20.1 4.89,35.88 5.84,36.83 5.84,39.03 R36.2
N$14
  Top 0.61: R19.1 71.55,9.06 C17.1
N$15
  Top 0.406: R3.2 75.46,17.46 U$8.1
N$16
  Top 0.406: R6.2 75.46,23.81 U$7.1
N$17
  Top 0.61: R20.1 C18.1
N$18
  Top 0.406: U$5.1 9.91,36.1 9.91,39.28 R1.2
N$19
  Top 0.406: R27.2 56.87,37.17 D10.A
N$20
  Top 0.61: R50.1 38.02,13.8 R49.2 40.25,13.8 U$32.C
N$21
  Top 0.406: D13.A 26.72,13.63 R29.2
N$24
  Top 0.61: Q20.2 62.21,73.34 Q18.3
N$25
  Top 0.61: Q18.2 66.53,73.34 Q21.3
N$27
  Bottom 1.27: U$14.$P9 25.15,72.64 20.57,72.64 U$13.$P8
N$28
  Bottom 0.61: U$13.$P3 13.97,62.74 15.58,61.13 Q6.3
N$29
  Top 0.406: U$25.C 45.63,63.87 R33.2 45.63,62.15 R34.1
N$31
  Bottom 1.27: U$15.$P9 35.31,72.64 30.48,72.64 29.21,71.37 U$14.$P8
N$32
  Bottom 0.406: Q5.3 18.96,53.34 19.21,53.59 19.21,55.29 19,55.5 18.96,55.5 18.29,56.17 18.29,58.17 18.29,59.82 19.05,60.58 U$13.$P12
  Bottom 0.61: U$13.$P12 19.07,60.98 D2.A
N$34
  Top 0.406: R22.2 24.55,56.67 D4.A
N$35  (via drill 0.35)
  Top 0.61: U$14.$P3 24.13,62.99 v25.91,61.21
  Bottom 0.61: v25.91,61.21 25.99,61.13 Q11.3
N$37
  Top 0.406: R38.1 26.08,50.63 R37.2 27.8,50.63 U$26.C
N$38
  Top 0.406: U$22.1 35.63,16.63 36.32,15.94
  Top 0.61: R50.2 36.32,15.94 C29.1
N$42
  Top 0.406: R21.2 34.71,55.91 D1.A
N$43  (via drill 0.35)
  Top 0.61: U$15.$P3 34.29,62.48 35.64,61.13 Q15.3
  other vias: 36.83,61.13
N$44
  Bottom 0.406: Q16.3 36.7,53.38 39.32,53.38 39.53,53.59 39.53,55.29 38.61,56.21 38.61,57.91 39.37,58.67 U$15.$P12
  Bottom 0.61: U$15.$P12 40.87,60.96 D15.A
N$49
  Top 0.406: U$29.C 37.22,49.99 R41.2 36.24,50.63 R42.1
N$52
  Top 0.61: R52.1 47.93,13.8 R51.2 50.15,13.8 U$33.C
N$53
  Top 0.406: U$23.1 45.53,16.63 46.23,15.94
  Top 0.61: R52.2 46.23,15.94 C30.1
N$59
  Top 0.61: U$34.C 14.62,30.65 R53.2 16.84,30.65 R54.1 18.96,32.35 20.49,30.82 R35.1
N$60
  Top 0.406: C31.1 18.48,27.75 19.3,26.92 19.3,26.26 U$24.1
  Top 0.61: C31.1 18.54,28.51 R54.2
N$65
  Top 0.61: R65.1 R57.2 | R57.2 22.49,13.04 U$36.C | R57.2 R58.1
N$68
  Top 0.61: R66.1 R59.2 | R59.2 16.14,13.04 U$37.C | R59.2 R60.1
N$71
  Top 0.61: R67.1 R61.2 | R61.2 25.29,4.66 U$38.C | R61.2 R62.1
N$74
  Top 0.61: R68.1 R63.2 | R63.2 31.64,4.66 U$39.C | R63.2 R64.1
OC_TH
  Top 0.406: R11.1 15.57,37 R43.2 18.03,39.46 18.03,42.13 U$17.4
PRECHARGE_COMP_F
  Top 0.61: R56.2 55.12,14.92 C32.1 Q7.1
PRECHARGE_COMPLETE
  Top 0.61: THROTTLE.3 55.27,5.08 58.67,5.08 59.94,6.35 59.94,8.38 58.67,9.65 58.17,9.65 57.15,10.67 R55.1
PRECHARGE_COMPLETE_3_3  (via drill 0.35)
  Top 0.254: v60.94,35.42 61.15,35.2 61.22,35.2 61.47,34.95 U1.42 | Q7.3 56.13,21.91 v51.97,26.07 | v53.26,28.62 53.05,28.83 53.05,32.32 52.68,32.7 52.68,37.25 54.26,38.83 54.26,39.11 54.61,39.47 55.12,39.47 55.42,39.16 55.48,39.16 v56.34,38.31
  Top 0.406: R74.1 53.94,18.8 55.54,18.8 Q7.3
  Bottom 0.254: v51.97,26.07 53.26,27.35 v53.26,28.62 | v56.34,38.31 57.82,36.83 58.67,36.83 59.25,36.26 59.25,35.97 59.8,35.42 v60.94,35.42
PWR
  Top 0.914: PWR.1 86.87,56.93 86.87,53.3 FUSE.P$1 FUSE.P$4
RTD_EN  (via drill 0.35)
  Top 0.254: Q21.1 R32.2 67.65,67.31 63.91,67.31 55.83,59.23 55.83,41.4 58.76,38.47 v59.04,38.47 | v59.86,36.22 59.97,36.11 U1.45
  Bottom 0.254: v59.04,38.47 59.04,37.84 58.89,37.69 58.89,37.19 v59.86,36.22
RTDS-
  Top 0.61: DRIVERS.3 86.07,16.63 Q4.3
RTDS_EN  (via drill 0.35)
  Top 0.254: Q4.1 82.7,11.43 79.25,11.43 77.62,13.06 70.16,13.06 v69.42,13.79 | v69.26,15.75 69.26,23.03 75.18,28.96 75.18,36.58 72.14,39.62 67.31,39.62 66.68,39 v66.68,36.1 | v64.77,34.95 64.38,34.56 64.38,33.34 64.21,33.17 63.22,33.17 62.97,33.42 U1.39
  Bottom 0.254: v69.42,13.79 69.42,15.59 v69.26,15.75 | v66.68,36.1 65.91,36.1 v64.77,34.95
SC_TH
  Top 0.406: R39.1 21.41,37 R40.2 23.05,38.76 U$16.3
SCL_TC  (via drill 0.35)
  Top 0.254: U$12.3 35.24,6.16 33.78,7.62 33.78,15.75 32,17.53 v31.5,17.53 | U2.42 23.62,30.73 23.11,30.23 23.11,22.86 v24.63,21.34
  Top 0.406: U$12.3 36.55,4.69 R48.2
  Bottom 0.254: v24.63,21.34 28.45,17.53 v31.5,17.53
SDA_TC  (via drill 0.35)
  Top 0.254: U$12.4 38.03,6.16 37.59,6.6 37.59,8.89 37.34,9.14 34.54,9.14 34.19,9.5 34.19,15.92 31.97,18.13 v30.65,18.13 | v24.68,22.15 23.52,23.31 23.52,29.77 23.98,30.23 U2.43
  Top 0.406: U$12.4 39.12,6.13 R47.2
  Bottom 0.254: v24.68,22.15 25.48,21.35 25.48,21.09 28.43,18.13 v30.65,18.13
SPI1_MISO
  Top 0.254: U2.17 50.04,29.72 56.64,23.11 59.44,23.11 59.97,23.65 U1.16
SPI1_MOSI  (via drill 0.35)
  Top 0.254: U2.16 48.9,29.23 v49.02,29.11 | U1.17 60.39,25.69 60.39,23.49 59.6,22.71 56.19,22.71 v51.51,27.38
  Bottom 0.254: v51.51,27.38 51.47,27.43 50.61,27.43 49.32,28.72 49.32,28.91 49.12,29.11 v49.02,29.11
SPI1_NSS  (via drill 0.35)
  Top 0.254: U2.14 48.48,28.22 48.6,28.1 50.2,28.1 v50.5,28.4 | v52.45,28.83 52.45,28.58 57.1,23.93 58.47,23.93 58.95,24.41 U1.14
  Bottom 0.254: v52.45,28.83 52.29,28.83 51.86,28.4 v50.5,28.4
SPI1_SCK  (via drill 0.35)
  Top 0.254: U1.15 59.46,23.71 59.27,23.52 56.9,23.52 51.61,28.81 v51.61,29 | v49.93,28.97 49.46,28.5 48.77,28.5 48.55,28.73 U2.15
  Bottom 0.254: v51.61,29 49.96,29 v49.93,28.97
SWCLK
  Top 0.254: JP1.4 71.88,31.24 71.88,32.26 71.12,33.02 67.56,33.02 65.02,35.56 64.52,35.56 63.96,35 U1.37
SWCLK_TC
  Top 0.254: JP2.4 35.26,38.35 33.45,40.16 32.59,40.16 31.98,39.55 31.98,37.62 30.91,36.55 26.39,36.55 24.74,34.9 U2.37
SWDIO
  Top 0.254: U1.34 69.83,31.73 JP1.3
SWDIO_TC
  Top 0.254: JP2.3 32.38,37.72 32.38,37.45 31.08,36.14 27.89,36.14 27.2,35.46 U2.34
THROTTLE_A
  Top 0.61: THROTTLE.1 50.95,9.4 48.26,9.4 46.74,10.92 41.15,10.92 39.97,12.1 R49.1
THROTTLE_A_F  (via drill 0.35)
  Top 0.406: U$22.3 U$22.4 38.74,20.86 R69.2 | U$12.6 39.15,10.19 v39.37,10.41
  Bottom 0.406: v39.37,10.41 39.37,16.41 U$22.3
  other vias: 37.53,18.26
THROTTLE_A_F_3_3  (via drill 0.35)
  Top 0.254: R69.1 42,21.84 54.23,21.84 v55.5,20.57 | v57.15,20.62 58.83,22.3 59.77,22.3 60.96,23.49 U1.18
  Top 0.406: R73.2 40.73,20.24 R69.1
  Bottom 0.254: v55.5,20.57 57.1,20.57 v57.15,20.62
THROTTLE_B
  Top 0.61: R51.1 50.2,10.16 55.37,10.16 57.22,8.31 THROTTLE.2
THROTTLE_B_F
  Top 0.406: U$23.3 U$23.4 48.65,20.86 R46.2
THROTTLE_B_F_3_3  (via drill 0.35)
  Top 0.254: R46.1 54.36,20.57 v55.12,19.81 | v57.15,19.81 57.35,20.01 58.06,20.01 61.47,23.42 U1.19
  Top 0.406: R72.2 50.63,20.24 R46.1
  Bottom 0.254: v55.12,19.81 v57.15,19.81
THROTTLE_OUT
  Top 0.406: U$18.3 U$18.4
  Top 0.61: THROTTLE.4 57.22,2.61 55.37,0.76 50.04,0.76 47.75,3.05 47.75,4.16 U$18.4
TSAL_EN
  Top 0.406: TSAL_EN.2 49.21,65.07 Q10.1
TSAL_HV-
  Top 0.61: U$8.3 78.23,17.44 78.23,20.57 80.52,22.86 83.97,22.86 DRIVERS.4
TSAL_HV_EN  (via drill 0.35)
  Top 0.254: R3.1 73.6,19.05 v69.87,22.78 | U1.22 63.06,25.67 63.06,24.9 64.59,23.37 v66.63,23.37
  Bottom 0.254: v69.87,22.78 69.28,23.37 v66.63,23.37
TSAL_LV-
  Top 0.61: U$7.3 79.4,24.96 DRIVERS.2
TSAL_LV_EN  (via drill 0.35)
  Top 0.254: U1.25 65.43,26.75 v66.63,25.56 | v70.44,23.35 72.49,25.4 R6.1
  Bottom 0.254: v66.63,25.56 68.41,23.77 69.73,23.77 70.15,23.35 v70.44,23.35

## Text on the board
tNames: BSPD | BMS | IMD | Andrew Smith | Safety Board | Illini Formula Electric | Tractive System | Apollo 2019 V1.0